# EAGLE design esp-01-qwiic-devbrd-v1.2 (EAGLE 9.6.2)
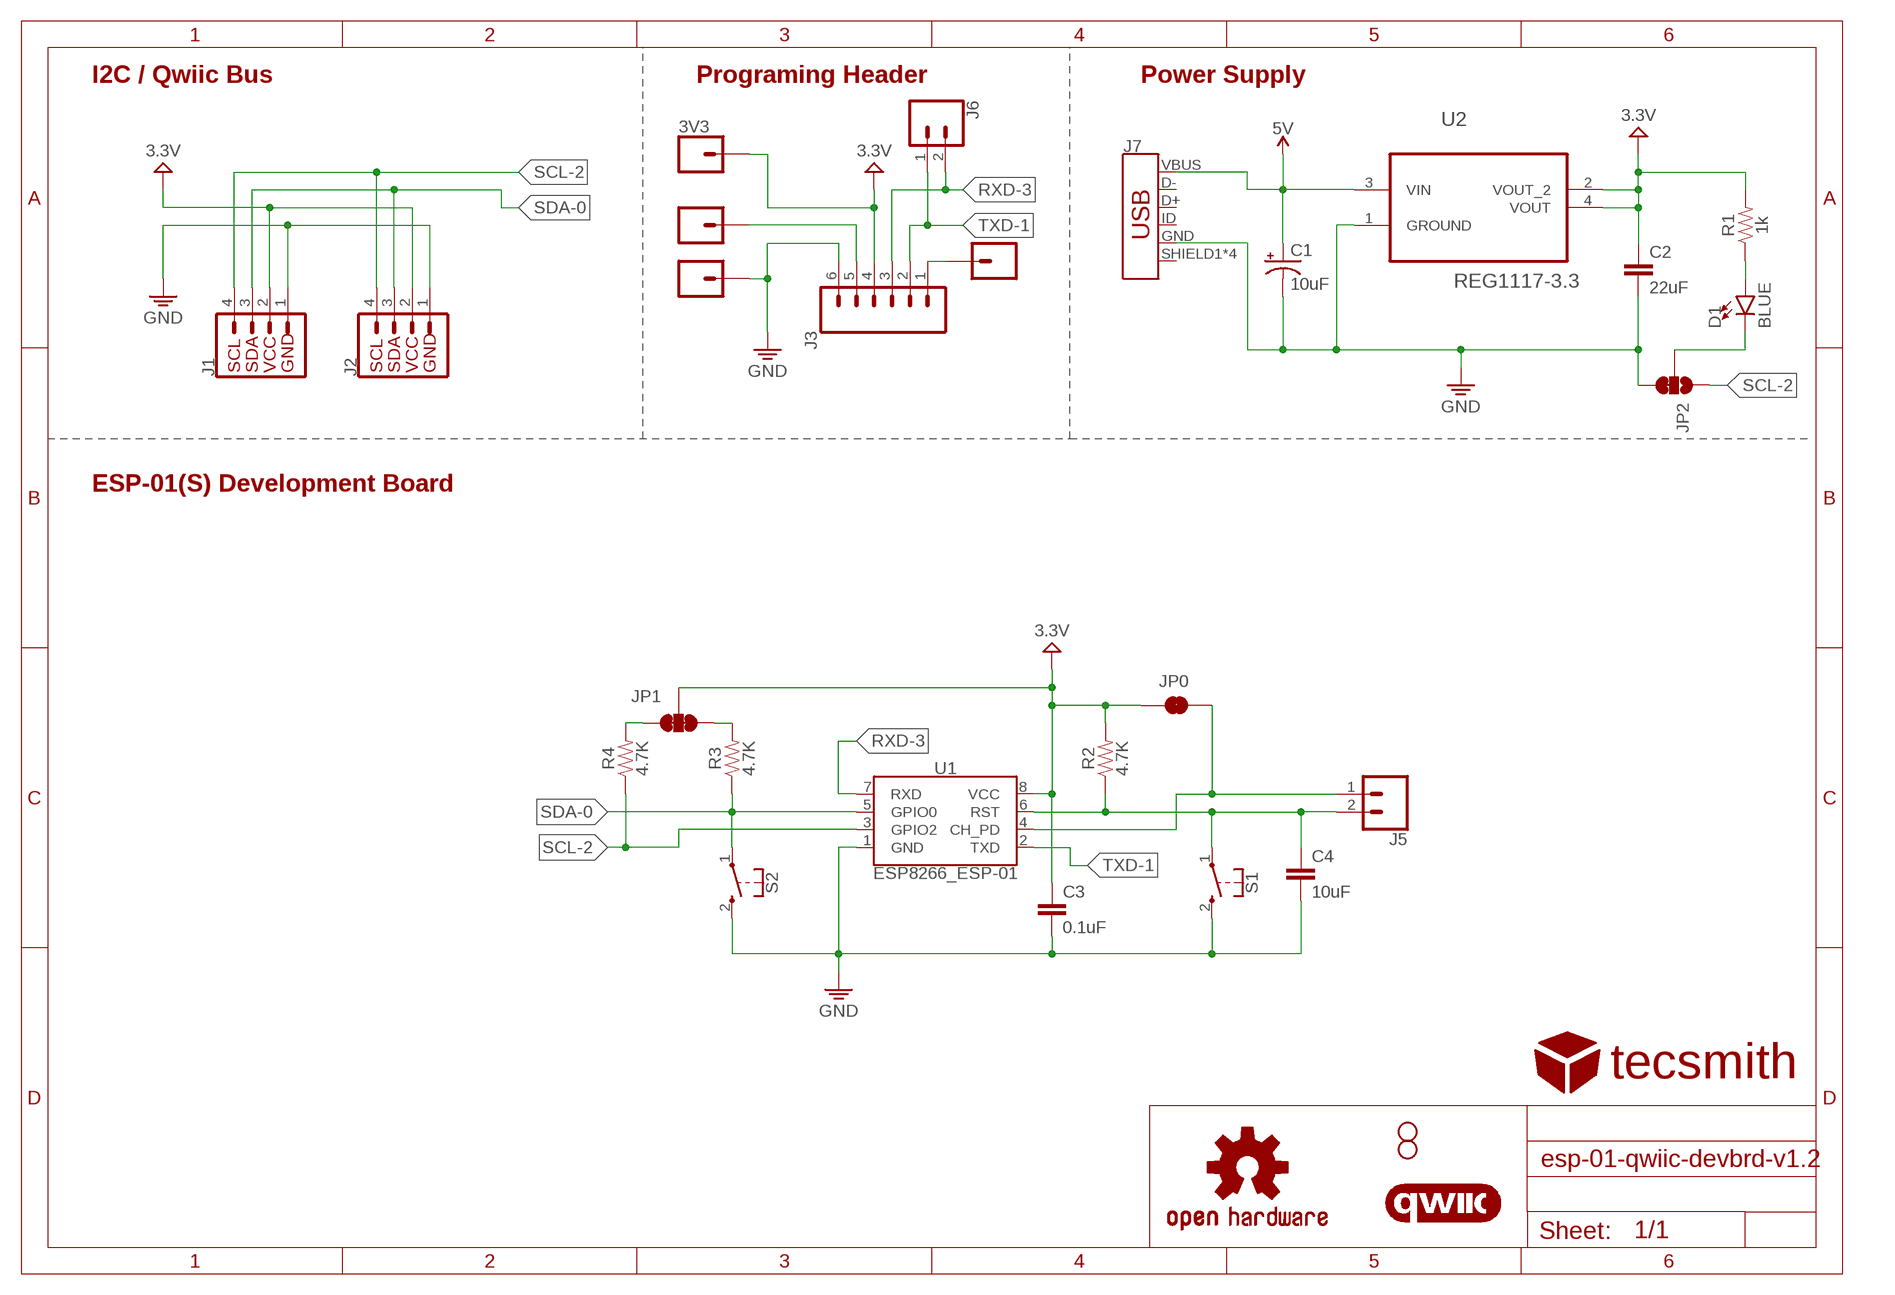
[diagram p0: schematic, sheet 1]

## Parts
3V3  CONN_01PTH_NO_SILK_YES_STOP  [1X01_NO_SILK]
C1  10uF  10UF-POLAR-EIA3216-16V-10%(TANT)  [EIA3216]
C2  22uF  22UF-0805-6.3V-20%  [0805]
C3  0.1uF  0.1UF-0603-25V-5%  [0603]
C4  10uF  10UF-0805-10V-10%  [0805]
D1  BLUE  LED-BLUE0603  [LED-0603]
H1  STAND-OFF  [STAND-OFF]
H2  STAND-OFF  [STAND-OFF]
J1  QWIIC_RIGHT_ANGLE  QWIIC_CONNECTORJS-1MM  [JST04_1MM_RA]
J2  I2C_STANDARD  [1X04]
J3  CONN_06NO_SILK_FEMALE_PTH  [1X06_NO_SILK]
J4  CONN_01PTH_NO_SILK_YES_STOP  [1X01_NO_SILK]
J5  CONN_02  [1X02]
J6  CONN_021X02_NO_SILK  [1X02_NO_SILK]
J7  USB_MICRO-B_FEMALE-SMT  [USB-B-MICRO-SMD]
J8  CONN_01PTH_NO_SILK_YES_STOP  [1X01_NO_SILK]
J9  CONN_01PTH_NO_SILK_YES_STOP  [1X01_NO_SILK]
JP0  JUMPER-SMT_2_NC_TRACE_SILK  [SMT-JUMPER_2_NC_TRACE_SILK]
JP1  JUMPER-SMT_3_2-NC_TRACE_SILK  [SMT-JUMPER_3_2-NC_TRACE_SILK]
JP2  JUMPER-SMT_3_1-NC_TRACE_SILK  [SMT-JUMPER_3_1-NC_TRACE_SILK]
LOGO1  OSHW-LOGOS  [OSHW-LOGO-S]
LOGO2  QWIIC_LOGO_6MM  [QWIIC_6MM]
R1  1k  1KOHM-0603-1/10W-1%  [0603]
R2  4.7K  RESISTOR0805  [0805]
R3  4.7K  RESISTOR0805  [0805]
R4  4.7K  RESISTOR0805  [0805]
S1  MOMENTARY-SWITCH-SPST-1  [SKRKAEE020]
S2  MOMENTARY-SWITCH-SPST-1  [SKRKAEE020]
U1  ESP8266_ESP-01  [ESP8266_ESP-01]
U2  REG1117-3.3  [SOT230P700X180-4N]
U$1  TECSMITH-LOGO  [TECSMITH-LOGO]

## Nets
5V: C1.+ J7.VBUS U2.3(VIN)
CTS: J3.5 J8.1
DTR: J3.1 J9.1
EN: J5.1 JP0.2 U1.4(CH_PD)
GND: C1.- C2.2 C3.2 C4.2 J1.1 J2.1 J3.6 J4.1 J7.GND JP2.3 S1.2 S2.2 U1.1(GND) U2.1(GROUND)
N$2: D1.C JP2.2
N$4: D1.A R1.1
N$6: JP1.3 R4.2
N$7: JP1.1 R3.2
RST: C4.1 J5.2 R2.1 S1.1 U1.6(RST)
RXD-3: J3.3 J6.2 U1.7(RXD)
SCL-2: J1.4 J2.4 JP2.1 R4.1 U1.3(GPIO2)
SDA-0: J1.3 J2.3 R3.1 S2.1 U1.5(GPIO0)
TXD-1: J3.2 J6.1 U1.2(TXD)
VCC: 3V3.1 C2.1 C3.1 J1.2 J2.2 J3.4 JP0.1 JP1.2 R1.2 R2.2 U1.8(VCC) U2.2(VOUT_2) U2.4(VOUT) ; supply symbol labelled 3.3V
Unconnected: J7.D+ J7.D- J7.ID J7.SHIELD1(SHIELD) J7.SHIELD2(SHIELD) J7.SHIELD3(SHIELD) J7.SHIELD4(SHIELD)

## Notes on the sheet
- I2C / Qwiic Bus | Programing Header | Power Supply
- ESP-01(S) Development Board

## Library data of the parts
3V3 J4 J8 J9 = SparkFun-Connectors:CONN_01: Single connection point. Often used as Generic Header-pin footprint for 0.1 inch spaced/style header connections On any of the 0.1 inch spaced packages, you can populate with these: Break Away Headers - Straight <https://www.sparkfun.com/products/116> (PRT-00116) Break Away Male Headers - Right Angle <https://www.sparkfun.com/products/553> (PRT-00553) Female Headers <https://www.sparkfun.com/products/115> (PRT-00115) Break Away Headers - Machine Pin <https://www.sparkfun.com/products/117> (PRT-00117) Break Away Female Headers - Swiss Machine Pin <https://www.sparkfun.com/products/743> (PRT-00743) This device is also useful as a general connection point to wire up your design to another part of your project. Our various solder wires solder well into these plated through hole pads. Hook-Up Wire - Assortment (Stranded, 22 AWG) <https://www.sparkfun.com/products/11375> (PRT-11375) Hook-Up Wire - Assortment (Solid Core, 22 AWG) <https://www.sparkfun.com/products/11367> (PRT-11367) View the entire wire category on our website here <https://www.sparkfun.com/categories/141> Special notes: SMTSO-256-ET is a "flush mount" nut for a 4-40 screw. We mostly use this on specialty testbeds; it is a nice way to connect hardware to your PCB at an adjustable hieght. Also note, the SNAP packages are for using a snappable style connector. We sell a baggie of snaps and they are also used on two LilyPad designs: Snap Assortment - 30 pack (male and female) <https://www.sparkfun.com/products/11347> (DEV-11347) LilyPad Arduino SimpleSnap <https://www.sparkfun.com/products/10941> (DEV-10941) LilyPad SimpleSnap Protoboard <https://www.sparkfun.com/products/10940> (DEV-10940)
C1 = SparkFun-Capacitors:10UF-POLAR: 10.0µF polarized capacitors A capacitor is a passive two-terminal electrical component used to store electrical energy temporarily in an electric field.; PROD_ID: CAP-00811
C2 = SparkFun-Capacitors:22UF: 22µF ceramic capacitors A capacitor is a passive two-terminal electrical component used to store electrical energy temporarily in an electric field.; PROD_ID: CAP-08402
C3 = SparkFun-Capacitors:0.1UF: 0.1µF ceramic capacitors A capacitor is a passive two-terminal electrical component used to store electrical energy temporarily in an electric field.; PROD_ID: CAP-08604
C4 = SparkFun-Capacitors:10UF: 10.0µF ceramic capacitors A capacitor is a passive two-terminal electrical component used to store electrical energy temporarily in an electric field.; PROD_ID: CAP-11330
D1 = SparkFun-LED:LED-BLUE: Blue SMD LED Used in manufacturing of various products at SparkFun Packages: 0603 - SMD 0603 package [Product Link] <http://www.digikey.com/product-detail/en/SMLE12BC7TT86/511-1589-2-ND/1641808> 1206 - SMD1206 package [Product Link] <http://www.digikey.com/product-detail/en/lite-on-inc/LTST-C150TBKT/160-1643-1-ND/573584> SparkFun Products: ESP8266 Thing-Dev Board <https://www.sparkfun.com/products/13711> RedBoard <https://www.sparkfun.com/products/12757>; PROD_ID: DIO-08575
H1 H2 = SparkFun-Hardware:STAND-OFF: Stand Off Drill holes for mechanically mounting via screws, standoffs, etc. Note: Use the keepout ring to avoid running the screw head into surrounding components. Variant Overviews STAND-OFF - Mechanical footprint for a #4 phillips button head screw. STAND-OFF-TIGHT - Mechanical footprint for a #4 phillips button head screw, Example SparkFun Products Screw - Phillips Head (1/4", 4-40, 10 pack) <https://www.sparkfun.com/products/10453> (PRT-10453) Screw - Phillips Head (1/2", 4-40, 10 pack) <https://www.sparkfun.com/products/10452> (PRT-10452) Screw - Phillips Head (3/4", 4-40, 10 pack) <https://www.sparkfun.com/products/10451> (PRT-10451) Screw - Phillips Head (1", 4-40, 10 pack) <https://www.sparkfun.com/products/10450> (PRT-10450)
J1 = SparkFun-Connectors:QWIIC_CONNECTOR: SparkFun I2C Standard Qwiic Connector An SMD 1mm pitch JST connector makes it easy and quick (get it? Qwiic?) to connect I2C devices to each other. The Qwiic system <http://www.sparkfun.com/qwiic> enables fast and solderless connection between popular platforms and various sensors and actuators. We carry 200mm <https://www.sparkfun.com/products/14204>, 100mm <https://www.sparkfun.com/products/14205>, 50mm <https://www.sparkfun.com/products/14206>, and breadboard friendly <https://www.sparkfun.com/products/14207> Qwiic cables. We also offer 10 pcs strips <https://www.sparkfun.com/products/14323> the SMD connectors.; PROD_ID: CONN-13694
J2 = SparkFun-Connectors:I2C_STANDARD: SparkFun I2C Standard Pinout Header SparkFun has standardized on a pinout for all I2C based sensor breakouts. This pinout allows I2C boards to be plugged directly into the headers on Arduino Uno compatible boards, and to be daisy chained easily. Example SparkFun Products: SparkFun Atmospheric Sensor Breakout - BME280 <https://www.sparkfun.com/products/13676> SparkFun Altitude/Pressure Sensor Breakout - MPL3115A2 <https://www.sparkfun.com/products/11084> SparkFun TOF Range Finder Sensor - VL6180 <https://www.sparkfun.com/products/12785>
J3 = SparkFun-Connectors:CONN_06: Multi connection point. Often used as Generic Header-pin footprint for 0.1 inch spaced/style header connections On any of the 0.1 inch spaced packages, you can populate with these: Break Away Headers - Straight <https://www.sparkfun.com/products/116> (PRT-00116) Break Away Male Headers - Right Angle <https://www.sparkfun.com/products/553> (PRT-00553) Female Headers <https://www.sparkfun.com/products/115> (PRT-00115) Break Away Headers - Machine Pin <https://www.sparkfun.com/products/117> (PRT-00117) Break Away Female Headers - Swiss Machine Pin <https://www.sparkfun.com/products/743> (PRT-00743) Arduino Stackable Header - 6 Pin <https://www.sparkfun.com/products/9280> (PRT-09280) For SCREWTERMINALS and SPRING TERMINALS visit here: Screw Terimnals on SparkFun.com <https://www.sparkfun.com/search/results?term=Screw+Terminals> (5mm/3.5mm/2.54mm spacing) This device is also useful as a general connection point to wire up your design to another part of your project. Our various solder wires solder well into these plated through hole pads. Hook-Up Wire - Assortment (Stranded, 22 AWG) <https://www.sparkfun.com/products/11375> (PRT-11375) Hook-Up Wire - Assortment (Solid Core, 22 AWG) <https://www.sparkfun.com/products/11367> (PRT-11367) View the entire wire category on our website here <https://www.sparkfun.com/categories/141>; PROD_ID: CONN-08437
J5 J6 = SparkFun-Connectors:CONN_02: Multi connection point. Often used as Generic Header-pin footprint for 0.1 inch spaced/style header connections On any of the 0.1 inch spaced packages, you can populate with these: Break Away Headers - Straight <https://www.sparkfun.com/products/116> (PRT-00116) Break Away Male Headers - Right Angle <https://www.sparkfun.com/products/553> (PRT-00553) Female Headers <https://www.sparkfun.com/products/115> (PRT-00115) Break Away Headers - Machine Pin <https://www.sparkfun.com/products/117> (PRT-00117) Break Away Female Headers - Swiss Machine Pin <https://www.sparkfun.com/products/743> (PRT-00743) For SCREWTERMINALS and SPRING TERMINALS visit here: Screw Terimnals on SparkFun.com <https://www.sparkfun.com/search/results?term=Screw+Terminals> (5mm/3.5mm/2.54mm spacing) This device is also useful as a general connection point to wire up your design to another part of your project. Our various solder wires solder well into these plated through hole pads. Hook-Up Wire - Assortment (Stranded, 22 AWG) <https://www.sparkfun.com/products/11375> (PRT-11375) Hook-Up Wire - Assortment (Solid Core, 22 AWG) <https://www.sparkfun.com/products/11367> (PRT-11367) View the entire wire category on our website here <https://www.sparkfun.com/categories/141> Special notes: Molex polarized connector foot print use with: PRT-08233 with associated crimp pins and housings. 2.54_SCREWTERM for use with PRT-10571. 3.5mm Screw Terminal footprints for PRT-08084 5mm Screw Terminal footprints for use with PRT-08432
J7 = VinoRodrigues_Custom_Eagle:USB_MICRO-B: USB Type Micro-B Connector Wurth Electronics: #629 105 136 821 <https://www.we-online.de/katalog/datasheet/629105136821.pdf>; PROD_ID: CONN-11752
JP0 = SparkFun-Jumpers:JUMPER-SMT_2_NC_TRACE: Normally closed trace jumper This jumper has a trace between two pads so it's normally closed (NC). Use a razor knife to open the connection. For best results follow the IPC guidelines for cutting traces: Cutout at least 0.063 mm (0.005 in). Remove all loose material to clean up the cut area. Seal the cut with an approved epoxy. Reapply solder to reclose the connection.
JP1 = SparkFun-Jumpers:JUMPER-SMT_3_2-NC_TRACE: Normally closed trace jumper (2 of 2 connections) This jumper has a trace between all three pads so they are normally closed (NC). Use a razor knife to open the connection(s). For best results follow the IPC guidelines for cutting traces: Cutout at least 0.063 mm (0.005 in). Remove all loose material to clean up the cut area. Seal the cut with an approved epoxy. Reapply solder to reclose the connection(s).
JP2 = SparkFun-Jumpers:JUMPER-SMT_3_1-NC_TRACE: Normally closed trace jumper (1 of 2 connections) This jumper has a trace between two pads so it's normally closed (NC). The other connection is normally open (NO). Use a razor knife to open the connection. For best results follow the IPC guidelines for cutting traces: Cutout at least 0.063 mm (0.005 in). Remove all loose material to clean up the cut area. Seal the cut with an approved epoxy. Reapply solder to reclose the connection, or to close the NO connection.
LOGO1 = SparkFun-Aesthetics:OSHW-LOGO: Open-Source Hardware (OSHW) Logo This logo indicates the piece of hardware it is found on incorporates a OSHW license and/or adheres to the definition of open source hardware found here: http://freedomdefined.org/OSHW
LOGO2 = SparkFun-Aesthetics:QWIIC_LOGO: Qwiic Logos for placement on schematic and PCB. The 5.5mm silk logo is best for placing next to Qwiic connector.
R1 = SparkFun-Resistors:1KOHM: 1kΩ resistor A resistor is a passive two-terminal electrical component that implements electrical resistance as a circuit element. Resistors act to reduce current flow, and, at the same time, act to lower voltage levels within circuits. - Wikipedia; PROD_ID: RES-07856
R2-R4 = SparkFun-Resistors:RESISTOR: Generic Resistor Package
S1 S2 = VinoRodrigues_Custom_Eagle:MOMENTARY-SWITCH-SPST-1: Momentary Switch (Pushbutton) - SPST - Two Circuits Normally-open (NO) SPST momentary switches (buttons, pushbuttons). Schematic symbol includes two switch circuits. Variants SMD-4.6MMX2.8MM - 4.60mm x 2.80mm Tactile Momentary Button Switch - Used on SparkFun SAMD21 Mini Breakout <https://www.sparkfun.com/products/13664> SMD-5.2MM - Mini Pushbutton Switch - SMD <https://www.sparkfun.com/products/8720> - Used on Arduino Pro Mini <https://www.sparkfun.com/products/11114>
U1 = VinoRodrigues_Custom_Eagle:ESP8266_ESP-01: ESP8266 ESP-01 Module The ESP8266 WiFi Module is a self contained SOC with integrated TCP/IP protocol stack that can give any microcontroller access to your WiFi network. The ESP8266 is capable of either hosting an application or offloading all Wi-Fi networking functions from another application processor. Each ESP8266 module comes pre-programmed with an AT command set firmware, meaning, you can simply hook this up to your Arduino device and get about as much WiFi-ability as a WiFi Shield offers (and that’s just out of the box)! The ESP8266 module is an extremely cost effective board with a huge, and ever growing, community. This module has a powerful enough on-board processing and storage capability that allows it to be integrated with the sensors and other application specific devices through its GPIOs with minimal development up-front and minimal loading during runtime. Its high degree of on-chip integration allows for minimal external circuitry, including the front-end module, is designed to occupy minimal PCB area. The ESP8266 supports APSD for VoIP applications and Bluetooth co-existance interfaces, it contains a self-calibrated RF allowing it to work under all operating conditions, and requires no external RF parts. SparkFun Product Page <https://www.sparkfun.com/products/13678>; SF_ID: WRL-13678
U2 = Texas Instruments_By_element14_Batch_1:REG1117-3.3: Low Dropout Positive Regulator; MPN: REG1117-3.3; OC_FARNELL: 1212355; OC_NEWARK: 35C1963; PACKAGE: SOT-223-4; SUPPLIER: Texas Instruments
U$1 = VinoRodrigues_Custom_Eagle:TECSMITH-LOGO

## Board
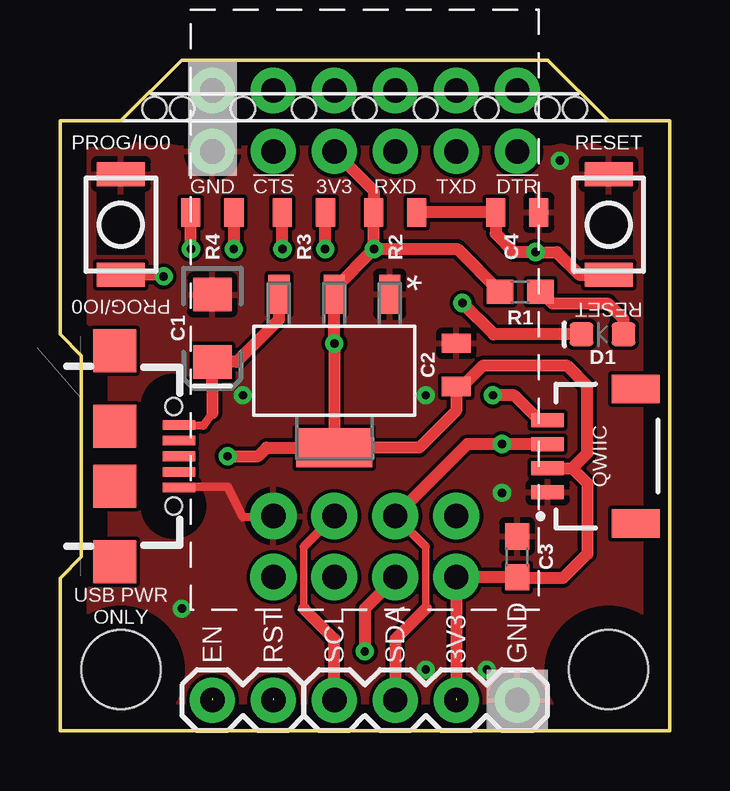
[diagram p1: board, top side]
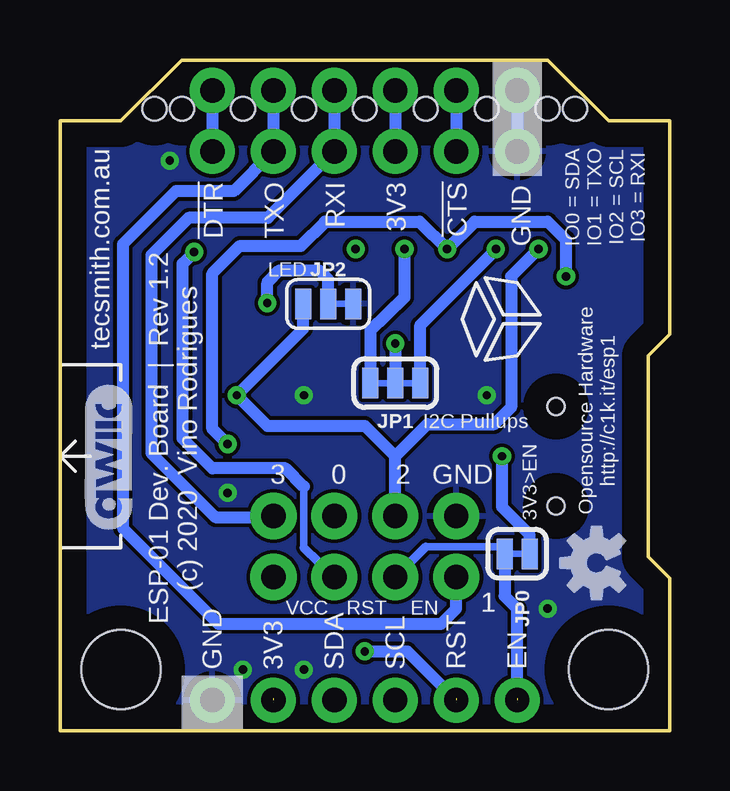
[diagram p2: board, bottom side, seen from below]

Size 25.4 x 27.94 mm. Coordinates in mm from the lower left corner, seen from the top.
Outline: 0,0 0,6.35 0.89,7.24 0.89,15.62 0,16.51 0,25.4 2.54,25.4 5.08,27.94 20.32,27.94 22.86,25.4 25.4,25.4 25.4,0 0,0
Copper layers (1*16): Top 0.035mm / dielectric 1.5mm / Bottom 0.035mm
Design rules "default": minimum track width 6mil, minimum drill 0.35mm, track to track 6mil, track to pad 6mil, pad to pad 6mil, via to via 6mil, smd to smd 6mil, copper to edge 40mil, drill to drill 6mil, minimum pad ring 10mil, minimum via ring 8mil, stop-mask expansion 4mil, vias tented up to drill 0mil, thermal gap 10mil
Holes 1 mm at 5.08,25.91 15.24,25.91 3.94,25.91 7.62,25.91 17.78,25.91 12.7,25.91 20.32,25.91 10.16,25.91 21.46,25.91

### Footprints (pad centres in the part's own frame; a part is rotated, then mirrored left to right if it is on the bottom)
1X01_NO_SILK = drill 1.016 pad 1.88: 1 0,0
EIA3216 = smd 1.4 x 1.6: + 1.4,0; - -1.4,0
0805 = smd 0.8 x 1.2: 1 -0.9,0; 2 0.9,0
0603 = smd 1.1 x 1: 1 -0.85,0; 2 0.85,0
LED-0603 = smd 1 x 1: A -0.877,0; C 0.877,0
STAND-OFF = hole 3.302: 0,0
JST04_1MM_RA = smd 0.6 x 1.35: 1 -1.5,0; 2 -0.5,0; 3 0.5,0; 4 1.5,0 | smd 1.2 x 2: NC1 2.8,-3.675; NC2 -2.8,-3.675
1X04 = drill 1.016 pad 1.88: 1 0,0; 2 2.54,0; 3 5.08,0; 4 7.62,0
1X06_NO_SILK = drill 1.016 pad 1.88: 1 0,0; 2 2.54,0; 3 5.08,0; 4 7.62,0; 5 10.16,0; 6 12.7,0
1X02 = drill 1.016 pad 1.88: 1 0,0; 2 2.54,0
1X02_NO_SILK = drill 1.016 pad 1.88: 1 0,0; 2 2.54,0
USB-B-MICRO-SMD = smd 0.4 x 1.35: D+ 0,2.675; D- -0.65,2.675; GND 1.3,2.675; ID 0.65,2.675; VBUS -1.3,2.675 | smd 1.8 x 1.8: SHIELD1 -4.4,0; SHIELD2 -1.25,0; SHIELD3 1.25,0; SHIELD4 4.4,0 | hole 0.7: 2.075,2.45; -2.075,2.45
SMT-JUMPER_2_NC_TRACE_SILK = smd 0.66 x 1.27: 1 -0.521,0; 2 0.521,0
SMT-JUMPER_3_2-NC_TRACE_SILK = smd 0.66 x 1.27: 1 -1.041,0; 2 0,0; 3 1.041,0
SMT-JUMPER_3_1-NC_TRACE_SILK = smd 0.66 x 1.27: 1 -1.041,0; 2 0,0; 3 1.041,0
SKRKAEE020 = smd 1 x 2: 1 -2.1,0; 2 2.1,0
ESP8266_ESP-01 = drill 1.016 pad 1.93: 1 -3.81,1.316; 2 -3.81,-1.224; 3 -1.27,1.316; 4 -1.27,-1.224; 5 1.27,1.316; 6 1.27,-1.224; 7 3.81,1.316; 8 3.81,-1.224
SOT230P700X180-4N = smd 1.626 x 0.889: 1 -3.2,2.311; 2 -3.2,0; 3 -3.2,-2.311 | smd 1.626 x 3.175: 4 3.2,0

### Placement (x,y rotation side)
3V3  11.43,24.13 0 top
C1  6.35,16.76 270 top
C2  16.51,15.24 90 top
C3  19.05,7.24 90 top
C4  19.05,21.59 0 top
D1  22.61,16.51 180 top
H1  22.86,2.54 0 top
H2  2.54,2.54 0 top
J1  20.32,11.43 90 top
J2  19.05,1.27 180 top
J3  19.05,26.67 180 top
J4  6.35,24.13 180 top
J5  6.35,1.27 0 top
J6  16.51,24.13 180 top
J7  2.29,11.43 270 top
J8  8.89,24.13 0 top
J9  19.05,24.13 0 top
JP0  6.35,7.37 180 bottom
JP1  11.43,14.48 0 bottom
JP2  14.22,17.78 0 bottom
LOGO1  3.05,6.99 90 bottom
LOGO2  23.37,11.43 90 bottom
R1  19.18,18.29 180 top
R2  13.97,21.59 180 top
R3  10.16,21.59 0 top
R4  6.35,21.59 0 top
S1  22.86,21.08 90 top
S2  2.54,21.08 90 top
U1  12.7,7.62 0 top
U2  11.43,14.99 270 top
U$1  7.11,17.14 90 bottom

### Tracks (layer width: path | path; a pad name or v marks a point on that pad's centre or on a via)
5V
  Top 0.356: J7.VBUS 5.97,12.7 6.36,13.24
  Top 0.508: 6.36,13.24 6.36,14.18 6.35,14.18 C1.+ 7.36,15.36 9.12,17.12 U2.3
CTS
  Bottom 0.508: J3.5 J8.1
DTR
  Bottom 0.508: J3.1 J9.1
EN  (1 unrouted)
  Bottom 0.305: 10.16,7.67 7.17,7.67 JP0.2
  Bottom 0.356: U1.4 10.16,7.67
  Bottom 0.508: JP0.2 6.87,5.6 6.35,5.08 6.35,1.35
GND  (via drill 0.35)
  Top 0.356: J7.GND 4.99,10.16 6.99,10.16 7.62,8.89 U1.1
  Bottom 0.508: J3.6 J4.1
  other vias: 18.41,9.91 20.83,23.75 15.24,2.54 17.78,2.54 5.08,5.08 15.24,13.97 7.62,13.97
  pour Top: 0,0 0,6.35 0.89,7.24 0.89,15.62 0,16.51 0,25.4 2.54,25.4 5.08,27.94 20.32,27.94 22.86,25.4 25.4,25.4 25.4,0
  pour Bottom: 0,0 0,6.35 0.89,7.24 0.89,15.62 0,16.51 0,25.4 2.54,25.4 5.08,27.94 20.32,27.94 22.86,25.4 25.4,25.4 25.4,0
N$2  (via drill 0.35)
  Top 0.508: D1.C 18.07,16.51 v16.76,17.81
  Bottom 0.508: JP2.2 14.22,18.8 14.61,19.18 16.26,19.18 16.76,18.67 v16.76,17.81
N$4
  Top 0.508: D1.A 23.48,17.13 22.82,17.8 20.52,17.8 R1.1
N$6  (via drill 0.35)
  Top 0.508: v7.24,20.07 v7.25,20.08 R4.2
  Bottom 0.508: JP1.3 10.39,16.89 7.24,20.04 v7.24,20.07
N$7  (via drill 0.35)
  Top 0.508: v11.05,20.07 v11.06,20.08 R3.2
  Bottom 0.508: v11.05,20.07 11.05,18.03 12.47,16.66 JP1.1
RST  (via drill 0.35)  (1 unrouted)
  Top 0.508: S1.1 21.66,18.98 20.7,19.94 v19.81,19.94 18.92,19.94 18.15,20.71 C4.1 R2.1 | U1.6 13.97,6.35 12.7,5.08 v12.7,3.3
  Bottom 0.305: 15.24,7.62 15.24,10.16
  Bottom 0.356: U1.6 15.24,7.62
  Bottom 0.508: 15.24,10.16 16,10.92 19.05,10.92 20.3,12.17 20.3,19.46 v19.81,19.94 | v12.7,3.3 10.92,3.3 8.97,1.35 8.89,1.35
RXD-3
  Bottom 0.508: J3.3 J6.2 16.74,21.36 20.04,21.36 21.59,19.81 21.59,11.56 18.92,8.89 16.56,8.89 U1.7
SCL-2  (via drill 0.35)
  Top 0.305: 10.16,7.67 10.16,5.08
  Top 0.356: U1.3 10.16,7.67
  Top 0.508: v5.46,20.07 v5.45,20.08 R4.1 | J1.4 19.96,12.93 18.92,13.97 v18.03,13.97 | J2.4 11.43,3.81 10.16,5.08
  Bottom 0.508: v5.46,20.07 6.6,18.92 6.6,13.46 7.3,12.76 10.1,12.76 11.43,11.43 | U1.3 11.43,11.43 | 11.43,11.43 12.7,12.7 16.76,12.7 v18.03,13.97 15.27,16.74 JP2.1
SDA-0  (via drill 0.35)
  Top 0.305: 15.24,7.67 15.24,5.08
  Top 0.356: U1.5 15.24,7.67
  Top 0.508: v9.27,20.07 v9.26,20.08 R3.1 | J1.3 18.42,11.93 v18.41,11.94 16.97,11.94 U1.5 | v4.32,18.92 4.26,18.98 S2.1 | J2.3 13.97,3.81 15.24,5.08
  Bottom 0.508: v4.32,18.92 4.32,20.45 5.08,21.21 8.13,21.21 v9.27,20.07 10.41,21.21 14.35,21.21 15.37,20.19 17.91,20.19 19.05,19.05 19.05,12.57 v18.41,11.94
TXD-1
  Bottom 0.508: J3.2 J6.1 18.16,22.48 20.57,22.48 22.78,20.27 22.78,8.43 18.8,4.45 9.53,4.45 8.89,5.08 U1.2
VCC  (via drill 0.35)  (1 unrouted)
  Top 0.508: v13.08,20.07 v13.07,20.08 R2.2 13.07,22.49 3V3.1 | 16.51,1.35 U1.8 C3.1 19.09,6.35 20.95,6.35 21.97,7.37 21.97,10.3 21.34,10.93 | J1.2 21.34,10.93 | 21.34,10.93 21.97,11.56 21.97,14.35 21.11,15.21 17.64,15.21 16.76,14.34 C2.1 16.51,13.34 14.96,11.79 U2.4 | v13.08,20.07 11.43,18.41 U2.2 v11.43,16.13 | v6.99,11.43 8.26,11.43 8.61,11.79 U2.4 | v11.43,16.13 U2.4 | 11.44,16.14 v11.43,16.13 | R1.2 16.55,20.07 v13.08,20.07
  Bottom 0.508: J3.4 3V3.1 | JP0.1 5.83,8.16 6.99,9.32 v6.99,11.42 v6.99,11.43 | v11.43,16.13 JP1.2

### Text on the board
tPlace: PROG/IO0 | RESET | GND | !CTS | 3V3 | RXD | TXD | !DTR | PROG/IO0 | RESET | QWIIC | USB PWR / ONLY | EN | RST | SCL | SDA | 3V3 | GND
bPlace: GND | !CTS | 3V3 | RXI | TXO | !DTR | IO0 = SDA / IO1 = TXO / IO2 = SCL / IO3 = RXI | tecsmith.com.au | LED | Opensource Hardware / http://c1k.it/esp1 | I2C Pullups | ESP-01 Dev. Board | Rev 1.2 / (c) 2020 Vino Rodrigues | GND | 2 | 0 | 3 | 3V3>EN | 1 | EN | RST | VCC | EN | RST | SCL | SDA | 3V3 | GND